# Altium schematic sheet ProgrammerSchematic.SchDoc
size A
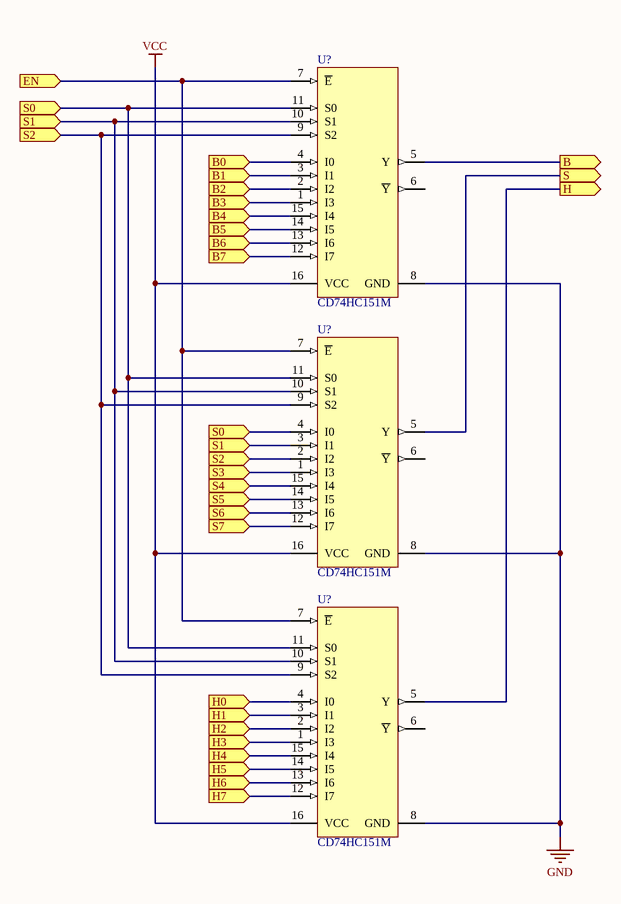
[diagram p0: ProgrammerSchematic.SchDoc]

## Parts
(Parts that share a designator on the sheet are numbered #1, #2 ... from top to bottom, then left to right.)
U?#1  CD74HC151M  [D0016A_N]
U?#2  CD74HC151M  [D0016A_N]
U?#3  CD74HC151M  [D0016A_N]

## Ports
B0 (in), B1 (in), B2 (in), B3 (in), B4 (in), B5 (in), B6 (in), B7 (in), B (out), EN (in), H0 (in), H1 (in), H2 (in), H3 (in), H4 (in), H5 (in), H6 (in), H7 (in), H (out), S0 (in), S1 (in), S2 (in), S3 (in), S4 (in), S5 (in), S6 (in), S7 (in), S (out)

## Nets
GND: U?#1.8(GND) U?#2.8(GND) U?#3.8(GND)
VCC: U?#1.16(VCC) U?#2.16(VCC) U?#3.16(VCC)
B: U?#1.5(Y) ; port B
B0: U?#1.4(I0) ; port B0
B1: U?#1.3(I1) ; port B1
B2: U?#1.2(I2) ; port B2
B3: U?#1.1(I3) ; port B3
B4: U?#1.15(I4) ; port B4
B5: U?#1.14(I5) ; port B5
B6: U?#1.13(I6) ; port B6
B7: U?#1.12(I7) ; port B7
EN: U?#1.7(~{E}) U?#2.7(~{E}) U?#3.7(~{E}) ; port EN
H: U?#3.5(Y) ; port H
H0: U?#3.4(I0) ; port H0
H1: U?#3.3(I1) ; port H1
H2: U?#3.2(I2) ; port H2
H3: U?#3.1(I3) ; port H3
H4: U?#3.15(I4) ; port H4
H5: U?#3.14(I5) ; port H5
H6: U?#3.13(I6) ; port H6
H7: U?#3.12(I7) ; port H7
S: U?#2.5(Y) ; port S
S0: U?#1.11(S0) U?#2.4(I0) U?#2.11(S0) U?#3.11(S0) ; port S0
S1: U?#1.10(S1) U?#2.3(I1) U?#2.10(S1) U?#3.10(S1) ; port S1
S2: U?#1.9(S2) U?#2.2(I2) U?#2.9(S2) U?#3.9(S2) ; port S2
S3: U?#2.1(I3) ; port S3
S4: U?#2.15(I4) ; port S4
S5: U?#2.14(I5) ; port S5
S6: U?#2.13(I6) ; port S6
S7: U?#2.12(I7) ; port S7

Not connected (* = marked no-connect by the designer): U?#1 6(~{Y}); U?#2 6(~{Y}); U?#3 6(~{Y})

## Library data of the parts
U?#1-U?#3 = CMP-1633-00204-2: High Speed CMOS Logic 8-Input Multiplexer, D0016A, TUBE; Manufacturer: Texas Instruments; VCC(Min)(V): 2; Output Drive (IOL/IOH)(Max)(mA): 5.2/-5.2; F @ Nom Voltage(Max)(Mhz): 28; ICC @ Nom Voltage(Max)(mA): 0.08; tpd @ Nom Voltage(Max)(ns): 43; Voltage(Nom)(V): 3.3,5; Function: Encoder/Multiplexer; Bits(#): 8; Channels(#): 1; Technology Family: HC; Configuration: 8：1; Schmitt Trigger: No; Rating: Catalog; Input Type: LVTTL/CMOS; VCC(Max)(V): 6; Output Type: CMOS; DatasheetVersion: SCHS150C; Code_JEDEC: MS-012 variation AC; Generic Part Number: CD74HC151; Type: Standard; PackageReference: D0016A; Operating Temperature Range(C): -55 to 125